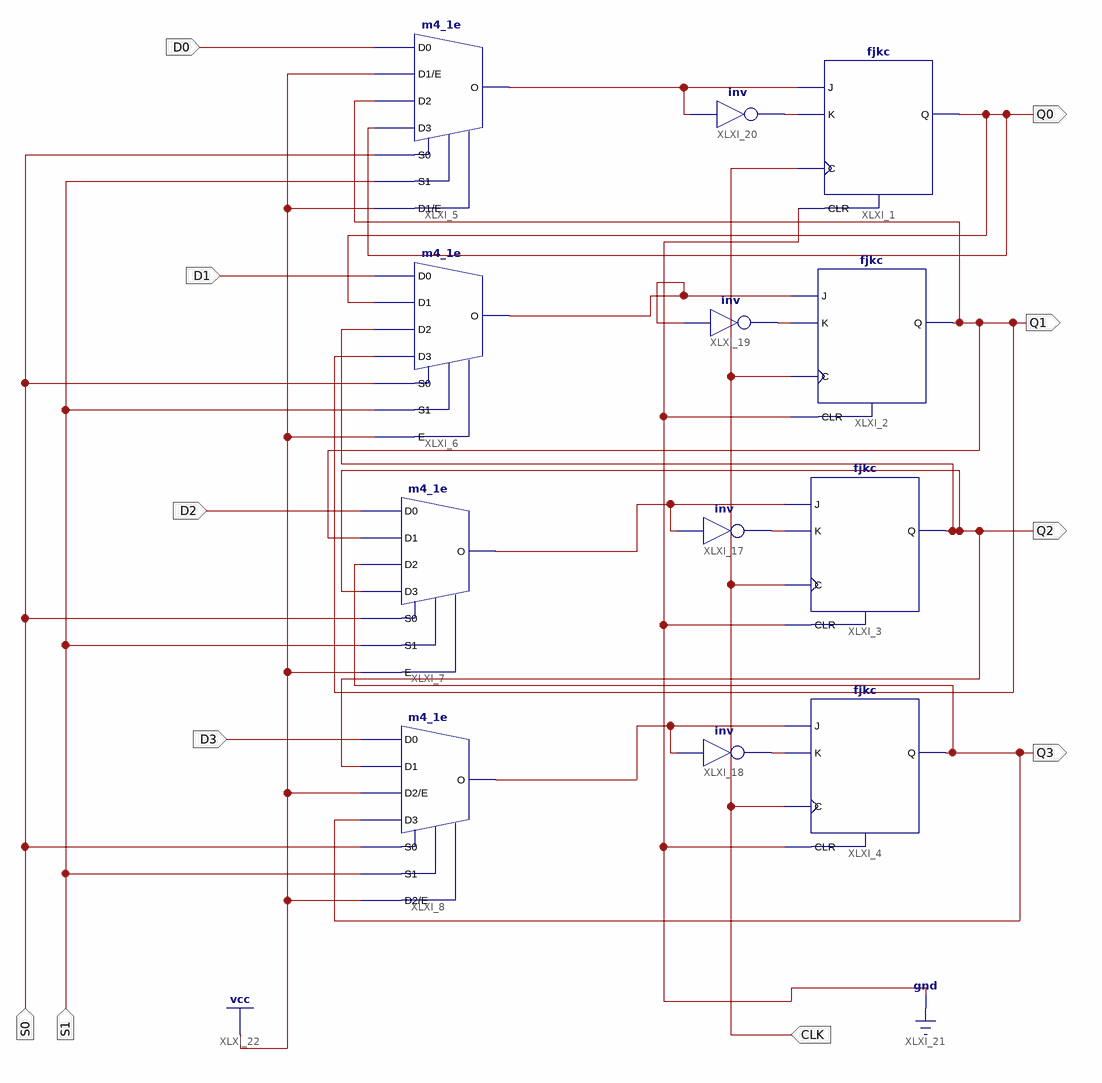
[diagram p0: schematic sheet 1]
// Xilinx ISE schematic BitShiftRegParalle.sch (zynq) as structural Verilog: 12 symbols, 11 ports
module BitShiftRegParalle (
  input  CLK,
  input  D0,
  input  D1,
  input  D2,
  input  D3,
  input  S0,
  input  S1,
  output Q0,
  output Q1,
  output Q2,
  output Q3
);

  wire XLXN_33, XLXN_34, XLXN_35, XLXN_36, XLXN_37, XLXN_38, XLXN_39, XLXN_40;

  fjkc XLXI_1 (.C(CLK), .CLR(1'b0), .J(XLXN_40), .K(XLXN_39), .Q(Q0));
  fjkc XLXI_2 (.C(CLK), .CLR(1'b0), .J(XLXN_33), .K(XLXN_38), .Q(Q1));
  fjkc XLXI_3 (.C(CLK), .CLR(1'b0), .J(XLXN_34), .K(XLXN_36), .Q(Q2));
  fjkc XLXI_4 (.C(CLK), .CLR(1'b0), .J(XLXN_35), .K(XLXN_37), .Q(Q3));
  m4_1e XLXI_5 (.D0(D0), .D1(1'b1), .D2(Q1), .D3(Q0), .E(1'b1), .S0(S0), .S1(S1), .O(XLXN_40));
  m4_1e XLXI_6 (.D0(D1), .D1(Q0), .D2(Q2), .D3(Q1), .E(1'b1), .S0(S0), .S1(S1), .O(XLXN_33));
  m4_1e XLXI_7 (.D0(D2), .D1(Q1), .D2(Q3), .D3(Q2), .E(1'b1), .S0(S0), .S1(S1), .O(XLXN_34));
  m4_1e XLXI_8 (.D0(D3), .D1(Q2), .D2(1'b1), .D3(Q3), .E(1'b1), .S0(S0), .S1(S1), .O(XLXN_35));
  not XLXI_17 (XLXN_36, XLXN_34);
  not XLXI_18 (XLXN_37, XLXN_35);
  not XLXI_19 (XLXN_38, XLXN_33);
  not XLXI_20 (XLXN_39, XLXN_40);
endmodule
